# Altium schematic sheet Waistband_mcu.SchDoc
size A; SheetNumber: 3; SheetTotal: 5
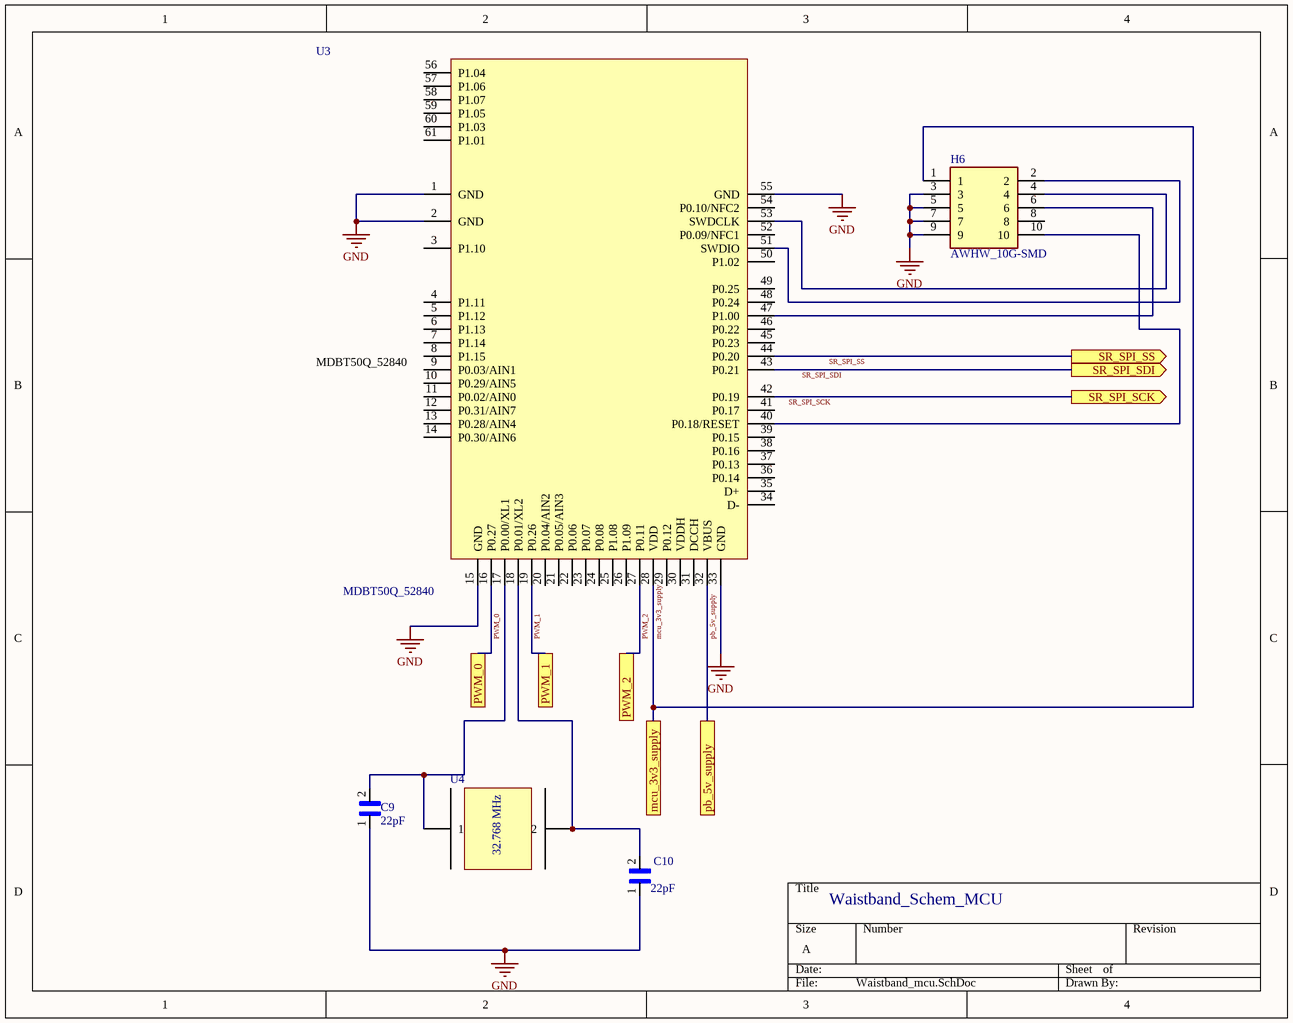
[diagram p0: Waistband_mcu.SchDoc]

## Parts
C9  22pF  [399-17627-1-ND]
C10  22pF  [399-17627-1-ND]
H6  AWHW_10G-SMD  [AWHW10GSMD]
U3  MDBT50Q_52840  [MDBT50Q_52840]
U4  FC13532.7680KAAC0  [FC-135 32.7680KA-AC0]  (value not drawn)

## Ports
mcu_3v3_supply, pb_5v_supply, PWM_0, PWM_1, PWM_2, SR_SPI_SCK (out), SR_SPI_SDI (out), SR_SPI_SS (out)

## Nets
GND: C9.1 C10.1 H6.3 H6.5 H6.7 H6.9 U3.1(GND) U3.2(GND) U3.15(GND) U3.33(GND) U3.55(GND)
mcu_3v3_supply: H6.1 U3.28(VDD) ; port mcu_3v3_supply
pb_5v_supply: U3.32(VBUS) ; port pb_5v_supply
PWM_0: U3.16(P0.27) ; port PWM_0
PWM_1: U3.19(P0.26) ; port PWM_1
PWM_2: U3.27(P0.11) ; port PWM_2
SR_SPI_SCK: U3.42(P0.19) ; port SR_SPI_SCK
SR_SPI_SDI: U3.43(P0.21) ; port SR_SPI_SDI
SR_SPI_SS: U3.44(P0.20) ; port SR_SPI_SS
NetC9_2: C9.2 U3.17(P0.00/XL1) U4.1
NetC10_2: C10.2 U3.18(P0.01/XL2) U4.2
NetH6_2: H6.2 U3.51(SWDIO)
NetH6_4: H6.4 U3.53(SWDCLK)
NetH6_6: H6.6 U3.47(P1.00)
NetH6_10: H6.10 U3.40(P0.18/RESET)

Not connected (* = marked no-connect by the designer): H6 8; U3 3(P1.10) 4(P1.11) 5(P1.12) 6(P1.13) 7(P1.14) 8(P1.15) 9(P0.03/AIN1) 10(P0.29/AIN5) 11(P0.02/AIN0) 12(P0.31/AIN7) 13(P0.28/AIN4) 14(P0.30/AIN6) 20(P0.04/AIN2) 21(P0.05/AIN3) 22(P0.06) 23(P0.07) 24(P0.08) 25(P1.08) 26(P1.09) 29(P0.12) 30(VDDH) 31(DCCH) 34(D-) 35(D+) 36(P0.14) 37(P0.13) 38(P0.16) 39(P0.15) 41(P0.17) 45(P0.23) 46(P0.22) 48(P0.24) 49(P0.25) 50(P1.02) 52(P0.09/NFC1) 54(P0.10/NFC2) 56(P1.04) 57(P1.06) 58(P1.07) 59(P1.05) 60(P1.03) 61(P1.01)

## Notes on the sheet
- Waistband_Schem_MCU
- (in symbol FC13532.7680KAAC0) 32.768 MHz

## Library data of the parts
C9 C10 = C0805C220K5RACAUTO: Cap Ceramic 22pF 50V X7R 10% SMD 0805 125°C Paper T/R; Manufacturer: KEMET; Supplier 1: Digi-Key; Manufacturer Part Number: C0805C220K5RACAUTO; RoHS: Yes; Category: Ceramic Capacitors; Stock 1: 12821; Pricing 1: 1=0.28000, 10=0.19000, 50=0.12680, 100=0.10770, 500=0.07604, 1000=0.06653 (USD); Mount: Surface Mount; Case/Package: 0805; Case Code (Imperial): 0805; Case Code (Metric): 2012; Min Operating Temperature: -55°C; Max Operating Temperature: 125°C; Packaging: Tape and Reel; Capacitance: 22pF; Tolerance: 10%; Voltage Rating: 50V; Ratings: AEC-Q200; RoHS Compliant: Yes; ComponentLink1URL: http://www.farnell.com/datasheets/2750125.pdf?src-supplier=Farnell; ComponentLink1Description: http://www.farnell.com/datasheets/2750125.pdf?src-supplier=Farnell; ComponentLink2URL: https://api.kemet.com/component-edge/download/datasheet/C0805C220K5RACAUTO.pdf?src-supplier=Digi-Key; ComponentLink2Description: https://api.kemet.com/component-edge/download/datasheet/C0805C220K5RACAUTO.pdf?src-supplier=Digi-Key; ComponentLink3URL: https://search.kemet.com/component-edge/download/datasheet/C0805C220K5RACAUTO.pdf?src-supplier=Digi-Key; ComponentLink3Description: https://search.kemet.com/component-edge/download/datasheet/C0805C220K5RACAUTO.pdf?src-supplier=Digi-Key; ComponentLink4URL: http://www.farnell.com/datasheets/2750125.pdf?src-supplier=Newark; ComponentLink4Description: http://www.farnell.com/datasheets/2750125.pdf?src-supplier=Newark; Supplier Part Number 1: 399-17627-1-ND
H6 = AWHW_10G-SMD: Connector; Manufacturer_Name: ASSMANN WSW components GmbH; Manufacturer_Part_Number: AWHW 10G-SMD; Datasheet Link: http://www.assmann-wsw.com/uploads/datasheets/ASS_2316_CO.pdf; Height: 10.75mm; Arrow Part Number: AWHW 10G-SMD; Arrow Price/Stock: https://www.arrow.com/en/products/awhw10g-smd/assmann-wsw-components-inc
U4 = FC13532.7680KAAC0: Crystal 0.032768MHz ±20ppm (Tol) 9pF FUND 70000Ohm 2-Pin CSMD T/R; Manufacturer: Epson; ESR (Equivalent Series Resistance): 70kR; Frequency: 32.768kHz; Drive Level: 0.5uW; Supplier 1: Arrow Electronics; Manufacturer Part Number: FC13532.7680KAAC0; RoHS: Yes; Category: Uncategorized; Mount: Surface Mount; Case/Package: SMD/SMT; Weight: 0.000564oz; Min Operating Temperature: -40°C; Max Operating Temperature: 85°C; Load Capacitance: 9pF; Packaging: Tape and Reel; Frequency Tolerance: 20ppm; Package Quantity: 1000; Tolerance: 20ppm; Termination: SMD/SMT; Frequency Stability: 20ppm; Series: FC-135; Length: 0.126inch; Width: 0.059inch; Height: 0.035inch; Radiation Hardening: No; ComponentLink1URL: http://www.mouser.com/ds/2/137/1699449-465441.pdf?src-supplier=Mouser; ComponentLink1Description: http://www.mouser.com/ds/2/137/1699449-465441.pdf?src-supplier=Mouser; ComponentLink2URL: http://components.arrow.com/part/dataview/43474691S8880657N1318?src-supplier=Arrow+Electronics; ComponentLink2Description: http://components.arrow.com/part/dataview/43474691S8880657N1318?src-supplier=Arrow+Electronics; ComponentLink3URL: https://www.verical.com/server-webapp/html/getDatasheet?partID=654709&src-supplier=Verical; ComponentLink3Description: https://www.verical.com/server-webapp/html/getDatasheet?partID=654709&src-supplier=Verical; ComponentLink4URL: https://support.epson.biz/td/api/doc_check.php?dl=brief_FC-135&lang=en&src-supplier=Digi-Key; ComponentLink4Description: https://support.epson.biz/td/api/doc_check.php?dl=brief_FC-135&lang=en&src-supplier=Digi-Key; ComponentLink5URL: https://support.epson.biz/td/api/doc_check.php?dl=brief_FC-135R_en.pdf&src-supplier=Digi-Key; ComponentLink5Description: https://support.epson.biz/td/api/doc_check.php?dl=brief_FC-135R_en.pdf&src-supplier=Digi-Key; Supplier Part Number 1: FC-135 32.7680KA-AC0